# Altium schematic sheet CM4_Home_Controller.SchDoc
size A4; SheetNumber: 1; SheetTotal: 10
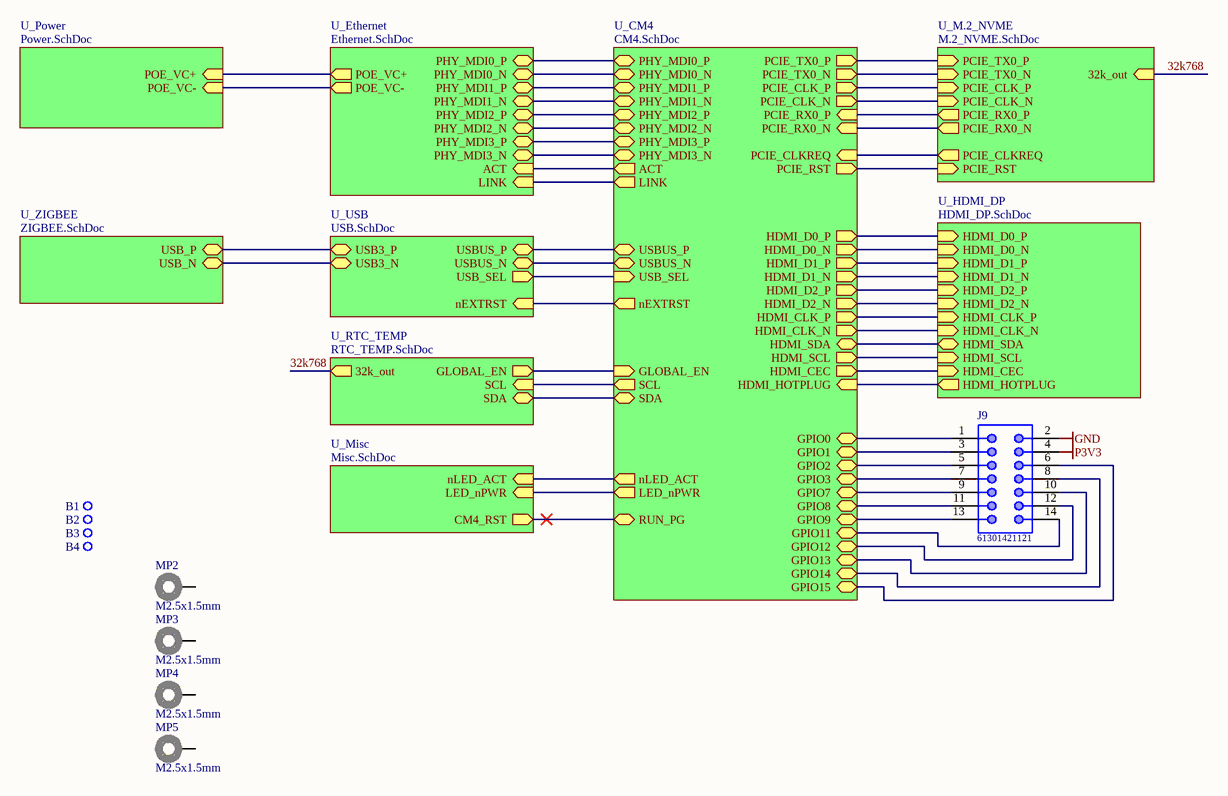
[diagram p0: CM4_Home_Controller.SchDoc]

## Parts
B1  Plated Hole  [MTG300_600]  (value not drawn)  (no BOM)
B2  Plated Hole  [MTG300_600]  (value not drawn)  (no BOM)
B3  Plated Hole  [MTG300_600]  (value not drawn)  (no BOM)
B4  Plated Hole  [MTG300_600]  (value not drawn)  (no BOM)
J9  61301421121  [61301421121]
MP2  M2.5x1.5mm  [9774015151]
MP3  M2.5x1.5mm  [9774015151]
MP4  M2.5x1.5mm  [9774015151]
MP5  M2.5x1.5mm  [9774015151]

## Sub-sheets
U_CM4 = CM4.SchDoc: PCIE_RX0_N (in), PCIE_RX0_P (in), PCIE_TX0_N (out), PCIE_TX0_P (out), PCIE_CLK_P (out), PCIE_CLK_N (out), PCIE_RST (out), PCIE_CLKREQ (in), PHY_MDI0_P (bidir), LINK (out), ACT (out), PHY_MDI3_N (bidir), PHY_MDI3_P (bidir), PHY_MDI2_N (bidir), PHY_MDI2_P (bidir), PHY_MDI1_N (bidir), PHY_MDI1_P (bidir), PHY_MDI0_N (bidir), USBUS_P (bidir), USBUS_N (bidir), HDMI_D0_P (out), HDMI_D0_N (out), HDMI_D1_P (out), HDMI_D1_N (out), HDMI_D2_P (out), HDMI_D2_N (out), HDMI_CLK_P (out), HDMI_CLK_N (out), HDMI_SDA (bidir), HDMI_SCL (out), HDMI_CEC (out), HDMI_HOTPLUG (in), GLOBAL_EN (in), SDA (bidir), nEXTRST (out), nLED_ACT (out), LED_nPWR (out), USB_SEL (in), SCL (out), RUN_PG (bidir), GPIO0 (bidir), GPIO12 (bidir), GPIO1 (bidir), GPIO14 (bidir), GPIO3 (bidir), GPIO11 (bidir), GPIO9 (bidir), GPIO2 (bidir), GPIO15 (bidir), GPIO13 (bidir), GPIO8 (bidir), GPIO7 (bidir)
U_Ethernet = Ethernet.SchDoc: PHY_MDI0_P (bidir), PHY_MDI0_N (bidir), PHY_MDI1_P (bidir), PHY_MDI1_N (bidir), PHY_MDI2_P (bidir), PHY_MDI2_N (bidir), PHY_MDI3_P (bidir), PHY_MDI3_N (bidir), ACT (in), LINK (in), POE_VC+ (out), POE_VC- (out)
U_HDMI_DP = HDMI_DP.SchDoc: HDMI_D1_P (in), HDMI_SCL (in), HDMI_D1_N (in), HDMI_CEC (in), HDMI_CLK_N (in), HDMI_HOTPLUG (out), HDMI_CLK_P (in), HDMI_SDA (bidir), HDMI_D2_N (in), HDMI_D0_P (in), HDMI_D0_N (in), HDMI_D2_P (in)
U_M.2_NVME = M.2_NVME.SchDoc: PCIE_RX0_N (out), PCIE_RX0_P (out), PCIE_TX0_N (in), PCIE_TX0_P (in), PCIE_CLK_P (in), PCIE_CLK_N (in), PCIE_RST (in), PCIE_CLKREQ (out), 32k_out (in)
U_Misc = Misc.SchDoc: nLED_ACT (in), LED_nPWR (in), CM4_RST (out)
U_Power = Power.SchDoc: POE_VC+ (in), POE_VC- (in)
U_RTC_TEMP = RTC_TEMP.SchDoc: 32k_out (out), GLOBAL_EN (out), SCL (in), SDA (bidir)
U_USB = USB.SchDoc: USBUS_P (bidir), USBUS_N (bidir), USB3_N (bidir), USB3_P (bidir), nEXTRST (in), USB_SEL (out)
U_ZIGBEE = ZIGBEE.SchDoc: USB_P (bidir), USB_N (bidir)

## Nets
GND: J9.2
P3V3: J9.4
32k768: sheet U_M.2_NVME/32k_out, sheet U_RTC_TEMP/32k_out
NetJ9_1: J9.1 ; sheet U_CM4/GPIO0
NetJ9_3: J9.3 ; sheet U_CM4/GPIO1
NetJ9_5: J9.5 ; sheet U_CM4/GPIO2
NetJ9_6: J9.6 ; sheet U_CM4/GPIO15
NetJ9_7: J9.7 ; sheet U_CM4/GPIO3
NetJ9_8: J9.8 ; sheet U_CM4/GPIO14
NetJ9_9: J9.9 ; sheet U_CM4/GPIO7
NetJ9_10: J9.10 ; sheet U_CM4/GPIO13
NetJ9_11: J9.11 ; sheet U_CM4/GPIO8
NetJ9_12: J9.12 ; sheet U_CM4/GPIO12
NetJ9_13: J9.13 ; sheet U_CM4/GPIO9
NetJ9_14: J9.14 ; sheet U_CM4/GPIO11
(unnamed): sheet U_CM4/PCIE_RX0_N, sheet U_M.2_NVME/PCIE_RX0_N
(unnamed): sheet U_CM4/PCIE_RX0_P, sheet U_M.2_NVME/PCIE_RX0_P
(unnamed): sheet U_CM4/PCIE_TX0_N, sheet U_M.2_NVME/PCIE_TX0_N
(unnamed): sheet U_CM4/PCIE_TX0_P, sheet U_M.2_NVME/PCIE_TX0_P
(unnamed): sheet U_CM4/PCIE_CLK_P, sheet U_M.2_NVME/PCIE_CLK_P
(unnamed): sheet U_CM4/PCIE_CLK_N, sheet U_M.2_NVME/PCIE_CLK_N
(unnamed): sheet U_CM4/PCIE_RST, sheet U_M.2_NVME/PCIE_RST
(unnamed): sheet U_CM4/PCIE_CLKREQ, sheet U_M.2_NVME/PCIE_CLKREQ
(unnamed): sheet U_CM4/PHY_MDI0_P, sheet U_Ethernet/PHY_MDI0_P
(unnamed): sheet U_CM4/LINK, sheet U_Ethernet/LINK
(unnamed): sheet U_CM4/ACT, sheet U_Ethernet/ACT
(unnamed): sheet U_CM4/PHY_MDI3_N, sheet U_Ethernet/PHY_MDI3_N
(unnamed): sheet U_CM4/PHY_MDI3_P, sheet U_Ethernet/PHY_MDI3_P
(unnamed): sheet U_CM4/PHY_MDI2_N, sheet U_Ethernet/PHY_MDI2_N
(unnamed): sheet U_CM4/PHY_MDI2_P, sheet U_Ethernet/PHY_MDI2_P
(unnamed): sheet U_CM4/PHY_MDI1_N, sheet U_Ethernet/PHY_MDI1_N
(unnamed): sheet U_CM4/PHY_MDI1_P, sheet U_Ethernet/PHY_MDI1_P
(unnamed): sheet U_CM4/PHY_MDI0_N, sheet U_Ethernet/PHY_MDI0_N
(unnamed): sheet U_CM4/USBUS_P, sheet U_USB/USBUS_P
(unnamed): sheet U_CM4/USBUS_N, sheet U_USB/USBUS_N
(unnamed): sheet U_CM4/HDMI_D0_P, sheet U_HDMI_DP/HDMI_D0_P
(unnamed): sheet U_CM4/HDMI_D0_N, sheet U_HDMI_DP/HDMI_D0_N
(unnamed): sheet U_CM4/HDMI_D1_P, sheet U_HDMI_DP/HDMI_D1_P
(unnamed): sheet U_CM4/HDMI_D1_N, sheet U_HDMI_DP/HDMI_D1_N
(unnamed): sheet U_CM4/HDMI_D2_P, sheet U_HDMI_DP/HDMI_D2_P
(unnamed): sheet U_CM4/HDMI_D2_N, sheet U_HDMI_DP/HDMI_D2_N
(unnamed): sheet U_CM4/HDMI_CLK_P, sheet U_HDMI_DP/HDMI_CLK_P
(unnamed): sheet U_CM4/HDMI_CLK_N, sheet U_HDMI_DP/HDMI_CLK_N
(unnamed): sheet U_CM4/HDMI_SDA, sheet U_HDMI_DP/HDMI_SDA
(unnamed): sheet U_CM4/HDMI_SCL, sheet U_HDMI_DP/HDMI_SCL
(unnamed): sheet U_CM4/HDMI_CEC, sheet U_HDMI_DP/HDMI_CEC
(unnamed): sheet U_CM4/HDMI_HOTPLUG, sheet U_HDMI_DP/HDMI_HOTPLUG
(unnamed): sheet U_CM4/GLOBAL_EN, sheet U_RTC_TEMP/GLOBAL_EN
(unnamed): sheet U_CM4/SDA, sheet U_RTC_TEMP/SDA
(unnamed): sheet U_CM4/nEXTRST, sheet U_USB/nEXTRST
(unnamed): sheet U_CM4/nLED_ACT, sheet U_Misc/nLED_ACT
(unnamed): sheet U_CM4/LED_nPWR, sheet U_Misc/LED_nPWR
(unnamed): sheet U_CM4/USB_SEL, sheet U_USB/USB_SEL
(unnamed): sheet U_CM4/SCL, sheet U_RTC_TEMP/SCL
(unnamed): sheet U_CM4/RUN_PG, sheet U_Misc/CM4_RST
(unnamed): sheet U_Power/POE_VC+, sheet U_Ethernet/POE_VC+
(unnamed): sheet U_Power/POE_VC-, sheet U_Ethernet/POE_VC-
(unnamed): sheet U_USB/USB3_N, sheet U_ZIGBEE/USB_N
(unnamed): sheet U_USB/USB3_P, sheet U_ZIGBEE/USB_P

Not connected (* = marked no-connect by the designer): B1 1; B2 1; B3 1; B4 1; MP2 1; MP3 1; MP4 1; MP5 1

## Library data of the parts
B1-B4 = PLATED_HOLE3.0_PAD6.0: Single Terminal Socket; Part Description: Plated Through Hole: Hole Dia.=3.0mm Pad Dia.=6.0mm; Mounted: No; Part Number: PLATED_HOLE3.0_PAD6.0; Component Type: Standard (No BOM); Pin Count: 1; Family: Plated Hole; Socket: No; SMD: No; Sense: No; Status: None; ComponentHeight: 0mm; HelpURL: Undefined; Author: CERN DEM JLC; CreateDate: 26.05.2008; LatestRevisionDate: 26.05.2008; PackageDescription: Plated Through Hole: Hole Dia.=3.0mm Pad Dia.=6.0mm
J9 = 61301421121: WR-PHD Pin Header, THT, pitch 2.54mm, Dual Row, Vertical, 14pin; Pin Number: 14; Gender: Male; Rated Current: 3A; Working Voltage: 250VAC; Withstanding Voltage: 500VAC; Contact Resistance: 20mOhm; ComponentLink1Description: Manufacturer; ComponentLink1URL: http://www.we-online.de; ComponentLink2Description: Datasheet; ComponentLink2URL: https://katalog.we-online.de/em/datasheet/6130xx21121.pdf; Part Number: 61301421121; Published Date: June 2019; Publisher: Wurth Elektronik; Pitch: 2.54mm; Operating Temperature: -40 to +105degC; Mounting Technology: THT; Packaging: Bag; Row Number: Dual; Orientation: Vertical
MP2-MP5 = 9774015151: WA-SMSI SMT Steel Spacer, internal Thread, OD 5.1mm, M2.5x1.5mm; Manufacturer: Wurth Elektronik; Inner Diameter: 3.5mm; Surface: Tin; Thread: M2.5; ComponentLink1Description: Manufacturer; ComponentLink1URL: http://www.we-online.de; ComponentLink2Description: Datasheet; ComponentLink2URL: https://www.we-online.com/catalog/datasheet/9774015151.pdf; Mounting Technology: SMT; Packaging: Bulk; Manufacturer Part Number: 9774015151; Length: 1.5mm; Inner Thread Length: -; Operating Temperature: -55 to +150degC; Outer Diameter: 5.1mm; Published Date: April 2020; Material: Steel